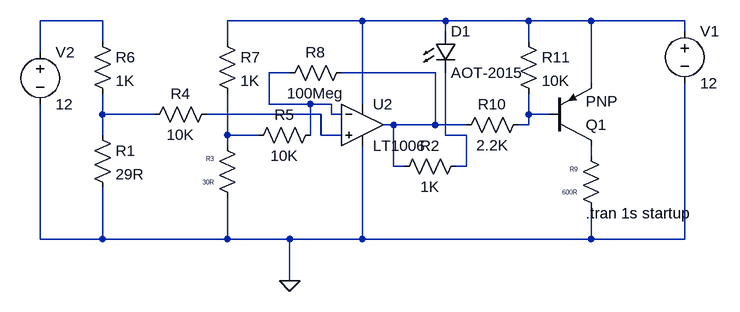
[diagram p0: schematic WarningBuzzer.asc]
WarningBuzzer.asc, the LTspice schematic file:
Version 4
SHEET 1 1020 680
WIRE 64 96 -32 96
WIRE 464 96 256 96
WIRE 592 96 464 96
WIRE 720 96 592 96
WIRE 816 96 720 96
WIRE 960 96 816 96
WIRE 592 112 592 96
WIRE 960 112 960 96
WIRE 64 128 64 96
WIRE 256 128 256 96
WIRE 720 128 720 96
WIRE -32 144 -32 96
WIRE 352 176 320 176
WIRE 576 176 432 176
WIRE 816 192 816 96
WIRE 320 224 320 176
WIRE 384 224 320 224
WIRE 416 224 384 224
WIRE 464 224 464 96
WIRE 64 240 64 208
WIRE 144 240 64 240
WIRE 400 240 224 240
WIRE 416 240 416 224
WIRE 432 240 416 240
WIRE 720 240 720 208
WIRE 752 240 720 240
WIRE 512 256 496 256
WIRE 576 256 576 176
WIRE 576 256 512 256
WIRE 624 256 576 256
WIRE 720 256 720 240
WIRE 720 256 704 256
WIRE 64 272 64 240
WIRE 256 272 256 208
WIRE 304 272 256 272
WIRE 384 272 384 224
WIRE 400 272 400 240
WIRE 432 272 400 272
WIRE 592 272 592 176
WIRE 624 272 592 272
WIRE 256 288 256 272
WIRE 816 304 816 288
WIRE 512 320 512 256
WIRE 528 320 512 320
WIRE 624 320 624 272
WIRE 624 320 608 320
WIRE -32 432 -32 224
WIRE 64 432 64 352
WIRE 64 432 -32 432
WIRE 256 432 256 368
WIRE 256 432 64 432
WIRE 352 432 256 432
WIRE 464 432 464 288
WIRE 464 432 352 432
WIRE 816 432 816 384
WIRE 816 432 464 432
WIRE 960 432 960 192
WIRE 960 432 816 432
WIRE 352 496 352 432
FLAG 352 496 0
SYMBOL res 48 256 R0
SYMATTR InstName R1
SYMATTR Value 29R
SYMBOL res 272 384 R180
WINDOW 0 36 76 Left 0
WINDOW 3 36 40 Left 0
SYMATTR InstName R3
SYMATTR Value 30R
SYMBOL voltage 960 96 R0
SYMATTR InstName V1
SYMATTR Value 12
SYMBOL res 288 288 R270
WINDOW 0 32 56 VTop 2
WINDOW 3 0 56 VBottom 2
SYMATTR InstName R5
SYMATTR Value 10K
SYMBOL res 48 112 R0
SYMATTR InstName R6
SYMATTR Value 1K
SYMBOL Opamps/LT1006 464 192 R0
SYMATTR InstName U2
SYMBOL res 512 336 R270
WINDOW 0 32 56 VTop 2
WINDOW 3 0 56 VBottom 2
SYMATTR InstName R2
SYMATTR Value 1K
SYMBOL res 128 256 R270
WINDOW 0 32 56 VTop 2
WINDOW 3 0 56 VBottom 2
SYMATTR InstName R4
SYMATTR Value 10K
SYMBOL res 240 112 R0
SYMATTR InstName R7
SYMATTR Value 1K
SYMBOL res 448 160 R90
WINDOW 0 0 56 VBottom 2
WINDOW 3 32 56 VTop 2
SYMATTR InstName R8
SYMATTR Value 100Meg
SYMBOL res 832 400 R180
WINDOW 0 36 76 Left 0
WINDOW 3 36 40 Left 0
SYMATTR InstName R9
SYMATTR Value 600R
SYMBOL res 608 272 R270
WINDOW 0 32 56 VTop 2
WINDOW 3 0 56 VBottom 2
SYMATTR InstName R10
SYMATTR Value 2.2K
SYMBOL voltage -32 128 R0
SYMATTR InstName V2
SYMATTR Value 12
SYMBOL pnp 752 288 M180
SYMATTR InstName Q1
SYMBOL res 704 112 R0
SYMATTR InstName R11
SYMATTR Value 10K
SYMBOL LED 576 112 R0
SYMATTR InstName D1
SYMATTR Value AOT-2015
TEXT 808 392 Left 2 !.tran 1s startup

The netlist it stands for:
* WarningBuzzer.asc
R1 N005 0 29R
R3 0 N008 30R
V1 N002 0 12
R5 N008 N003 10K
R6 N001 N005 1K
XU2 N006 N003 N002 0 N004 LT1006  ; pins In+ In- V+ V- OUT
R2 N004 N009 1K
R4 N005 N006 10K
R7 N002 N008 1K
R8 N004 N003 100Meg
R9 0 N010 600R
R10 N004 N007 2.2K
V2 N001 0 12
Q1 N010 N007 N002 0 PNP
R11 N002 N007 10K
D1 N002 N009 AOT-2015
.model D D
.lib standard.dio
.model NPN NPN
.model PNP PNP
.lib standard.bjt
.tran 1s startup
.lib LTC.lib
.backanno
.end